# Altium project OLED.PrjPCB
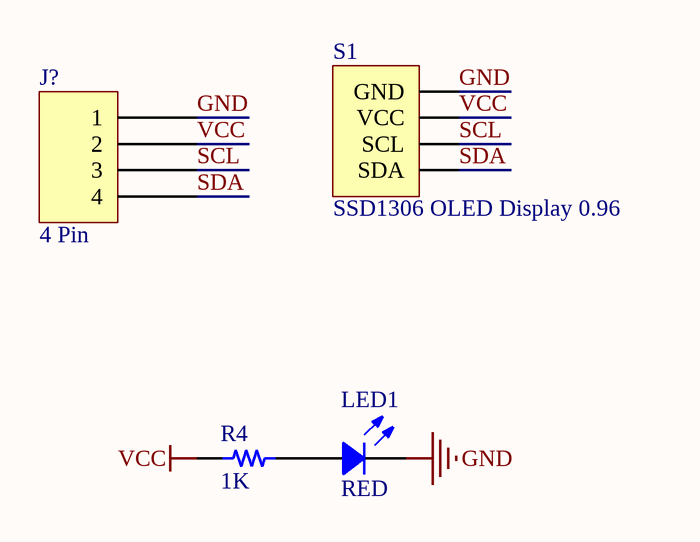
[diagram p0: OLED.SchDoc]
1 sheet, 4 parts. Net scope: global (net labels, ports and power ports of the same name join across sheets).
Board file: OLED.PcbDoc

## Sheet OLED.SchDoc
size A

### Parts
J?  4 Pin  [JST XH B4B-XH-A - RIGHT]
LED1  RED  [LED 0805/2012 RED]
R4  1K  [RES 1206/3216]
S1  SSD1306 OLED Display 0.96  [OLED]

### Nets
GND: J?.1 LED1.2 S1.1(GND)
VCC: J?.2 R4.2 S1.2(VCC)
SCL: J?.3 S1.3(SCL)
SDA: J?.4 S1.4(SDA)
NetLED1_1: LED1.1 R4.1

### Library data of the parts
LED1 = LED: Chip LED; Value: Green
R4 = Resistor: SMT Resistor; Value: 1K
S1 = OLED